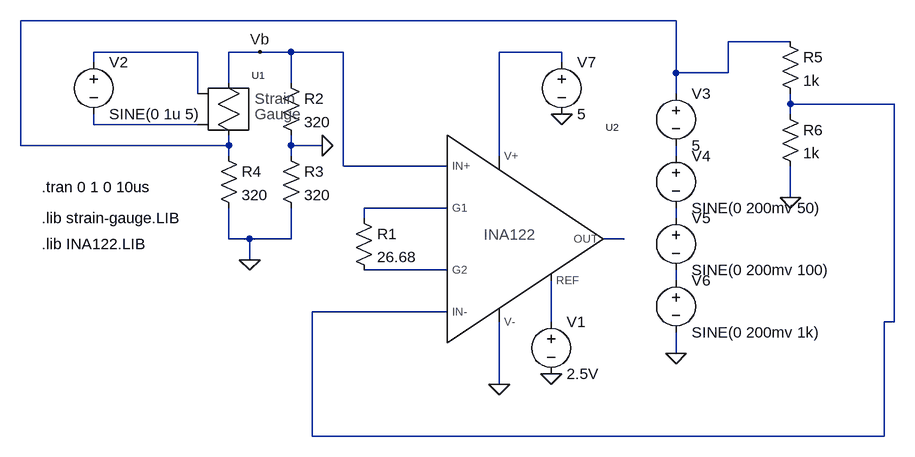
[diagram p0: schematic T5_8_pln.asc]
T5_8_pln.asc, the LTspice schematic file:
Version 4
SHEET 1 964 680
WIRE 624 -32 -384 -32
WIRE 800 0 704 0
WIRE -112 16 -272 16
WIRE -16 16 -64 16
WIRE 32 16 -16 16
WIRE 112 16 32 16
WIRE 448 16 352 16
WIRE -272 32 -272 16
WIRE 448 32 448 16
WIRE 624 48 624 -32
WIRE 704 48 704 0
WIRE 704 48 624 48
WIRE -64 64 -64 16
WIRE 32 64 32 16
WIRE -112 80 -112 16
WIRE 624 80 624 48
WIRE 800 96 800 80
WIRE 960 96 800 96
WIRE 800 112 800 96
WIRE -272 128 -272 112
WIRE -112 128 -272 128
WIRE -384 160 -384 -32
WIRE -64 160 -64 144
WIRE -64 160 -384 160
WIRE 32 160 32 144
WIRE 80 160 32 160
WIRE -64 176 -64 160
WIRE 32 176 32 160
WIRE 352 176 352 16
WIRE 624 176 624 160
WIRE 112 192 112 16
WIRE 272 192 112 192
WIRE 800 240 800 192
WIRE 272 256 144 256
WIRE 144 272 144 256
WIRE 624 272 624 256
WIRE -64 304 -64 256
WIRE -32 304 -64 304
WIRE 32 304 32 256
WIRE 32 304 -32 304
WIRE 544 304 512 304
WIRE -32 336 -32 304
WIRE 272 352 144 352
WIRE 624 368 624 352
WIRE 272 416 64 416
WIRE 432 432 432 368
WIRE 960 432 960 96
WIRE 960 432 944 432
WIRE 624 480 624 448
WIRE 352 528 352 432
WIRE 64 608 64 416
WIRE 944 608 944 432
WIRE 944 608 64 608
FLAG -32 336 0
FLAG -16 16 Vb
FLAG 352 528 0
FLAG 80 160 0
FLAG 800 240 0
FLAG 432 512 0
FLAG 624 480 0
FLAG 448 112 0
SYMBOL res 16 48 R0
SYMATTR InstName R2
SYMATTR Value 320
SYMBOL res 16 160 R0
SYMATTR InstName R3
SYMATTR Value 320
SYMBOL res -80 160 R0
SYMATTR InstName R4
SYMATTR Value 320
SYMBOL strain-gauge -80 48 R0
SYMATTR SpiceLine R=320 L=0.32 k=1.76 n=32
SYMATTR InstName U1
SYMBOL voltage -272 16 R0
WINDOW 123 0 0 Left 0
WINDOW 39 0 0 Left 0
SYMATTR InstName V2
SYMATTR Value SINE(0 1u 5)
SYMBOL INA122 256 256 R0
SYMATTR InstName U2
SYMBOL voltage 624 64 R0
WINDOW 123 0 0 Left 0
WINDOW 39 0 0 Left 0
SYMATTR InstName V3
SYMATTR Value 5
SYMBOL res 128 256 R0
SYMATTR InstName R1
SYMATTR Value 26.68
SYMBOL res 784 -16 R0
SYMATTR InstName R5
SYMATTR Value 1k
SYMBOL res 784 96 R0
SYMATTR InstName R6
SYMATTR Value 1k
SYMBOL voltage 432 416 R0
WINDOW 123 0 0 Left 0
WINDOW 39 0 0 Left 0
SYMATTR InstName V1
SYMATTR Value 2.5V
SYMBOL voltage 624 160 R0
WINDOW 123 0 0 Left 0
WINDOW 39 0 0 Left 0
SYMATTR InstName V4
SYMATTR Value SINE(0 200mv 50)
SYMBOL voltage 624 256 R0
WINDOW 123 0 0 Left 0
WINDOW 39 0 0 Left 0
SYMATTR InstName V5
SYMATTR Value SINE(0 200mv 100)
SYMBOL voltage 624 352 R0
WINDOW 123 0 0 Left 0
WINDOW 39 0 0 Left 0
SYMATTR InstName V6
SYMATTR Value SINE(0 200mv 1k)
SYMBOL voltage 448 16 R0
WINDOW 123 0 0 Left 0
WINDOW 39 0 0 Left 0
SYMATTR InstName V7
SYMATTR Value 5
TEXT -352 272 Left 2 !.lib strain-gauge.LIB
TEXT -352 224 Left 2 !.tran 0 1 0 10us
TEXT -352 312 Left 2 !.lib INA122.LIB

The netlist it stands for:
* T5_8_pln.asc
R2 Vb 0 320
R3 0 0 320
R4 N001 0 320
XU1 Vb N001 N002 N005 strain-gauge R=320 L=0.32 k=1.76 n=32  ; pins 1 2 3 4
V2 N002 N005 SINE(0 1u 5)
XU2 Vb N004 N012 N003 0 N007 N010 N009 INA122  ; pins IN+ IN- REF V+ V- G1 G2 OUT
V3 N001 N006 5
R1 N007 N010 26.68
R5 N001 N004 1k
R6 N004 0 1k
V1 N012 0 2.5V
V4 N006 N008 SINE(0 200mv 50)
V5 N008 N011 SINE(0 200mv 100)
V6 N011 0 SINE(0 200mv 1k)
V7 N003 0 5
.lib strain-gauge.LIB
.tran 0 1 0 10us
.lib INA122.LIB
.lib strain-gauge.LIB
.lib INA122.LIB
.backanno
.end